# EasyEDA Pro project Meshtastic-MiniX-FakeTec.epro

# Schematic Schematic1_1
Board Name: Board1_1; Create Date: 2025-11-05; Page Name: P1; Project Name: Meshtastic-Mini; Schematic Name: Schematic1_1; Update Date: 2025-11-13; Company: TESLA; Drawed: chanchu; Page Size: A3; Version: V1.0
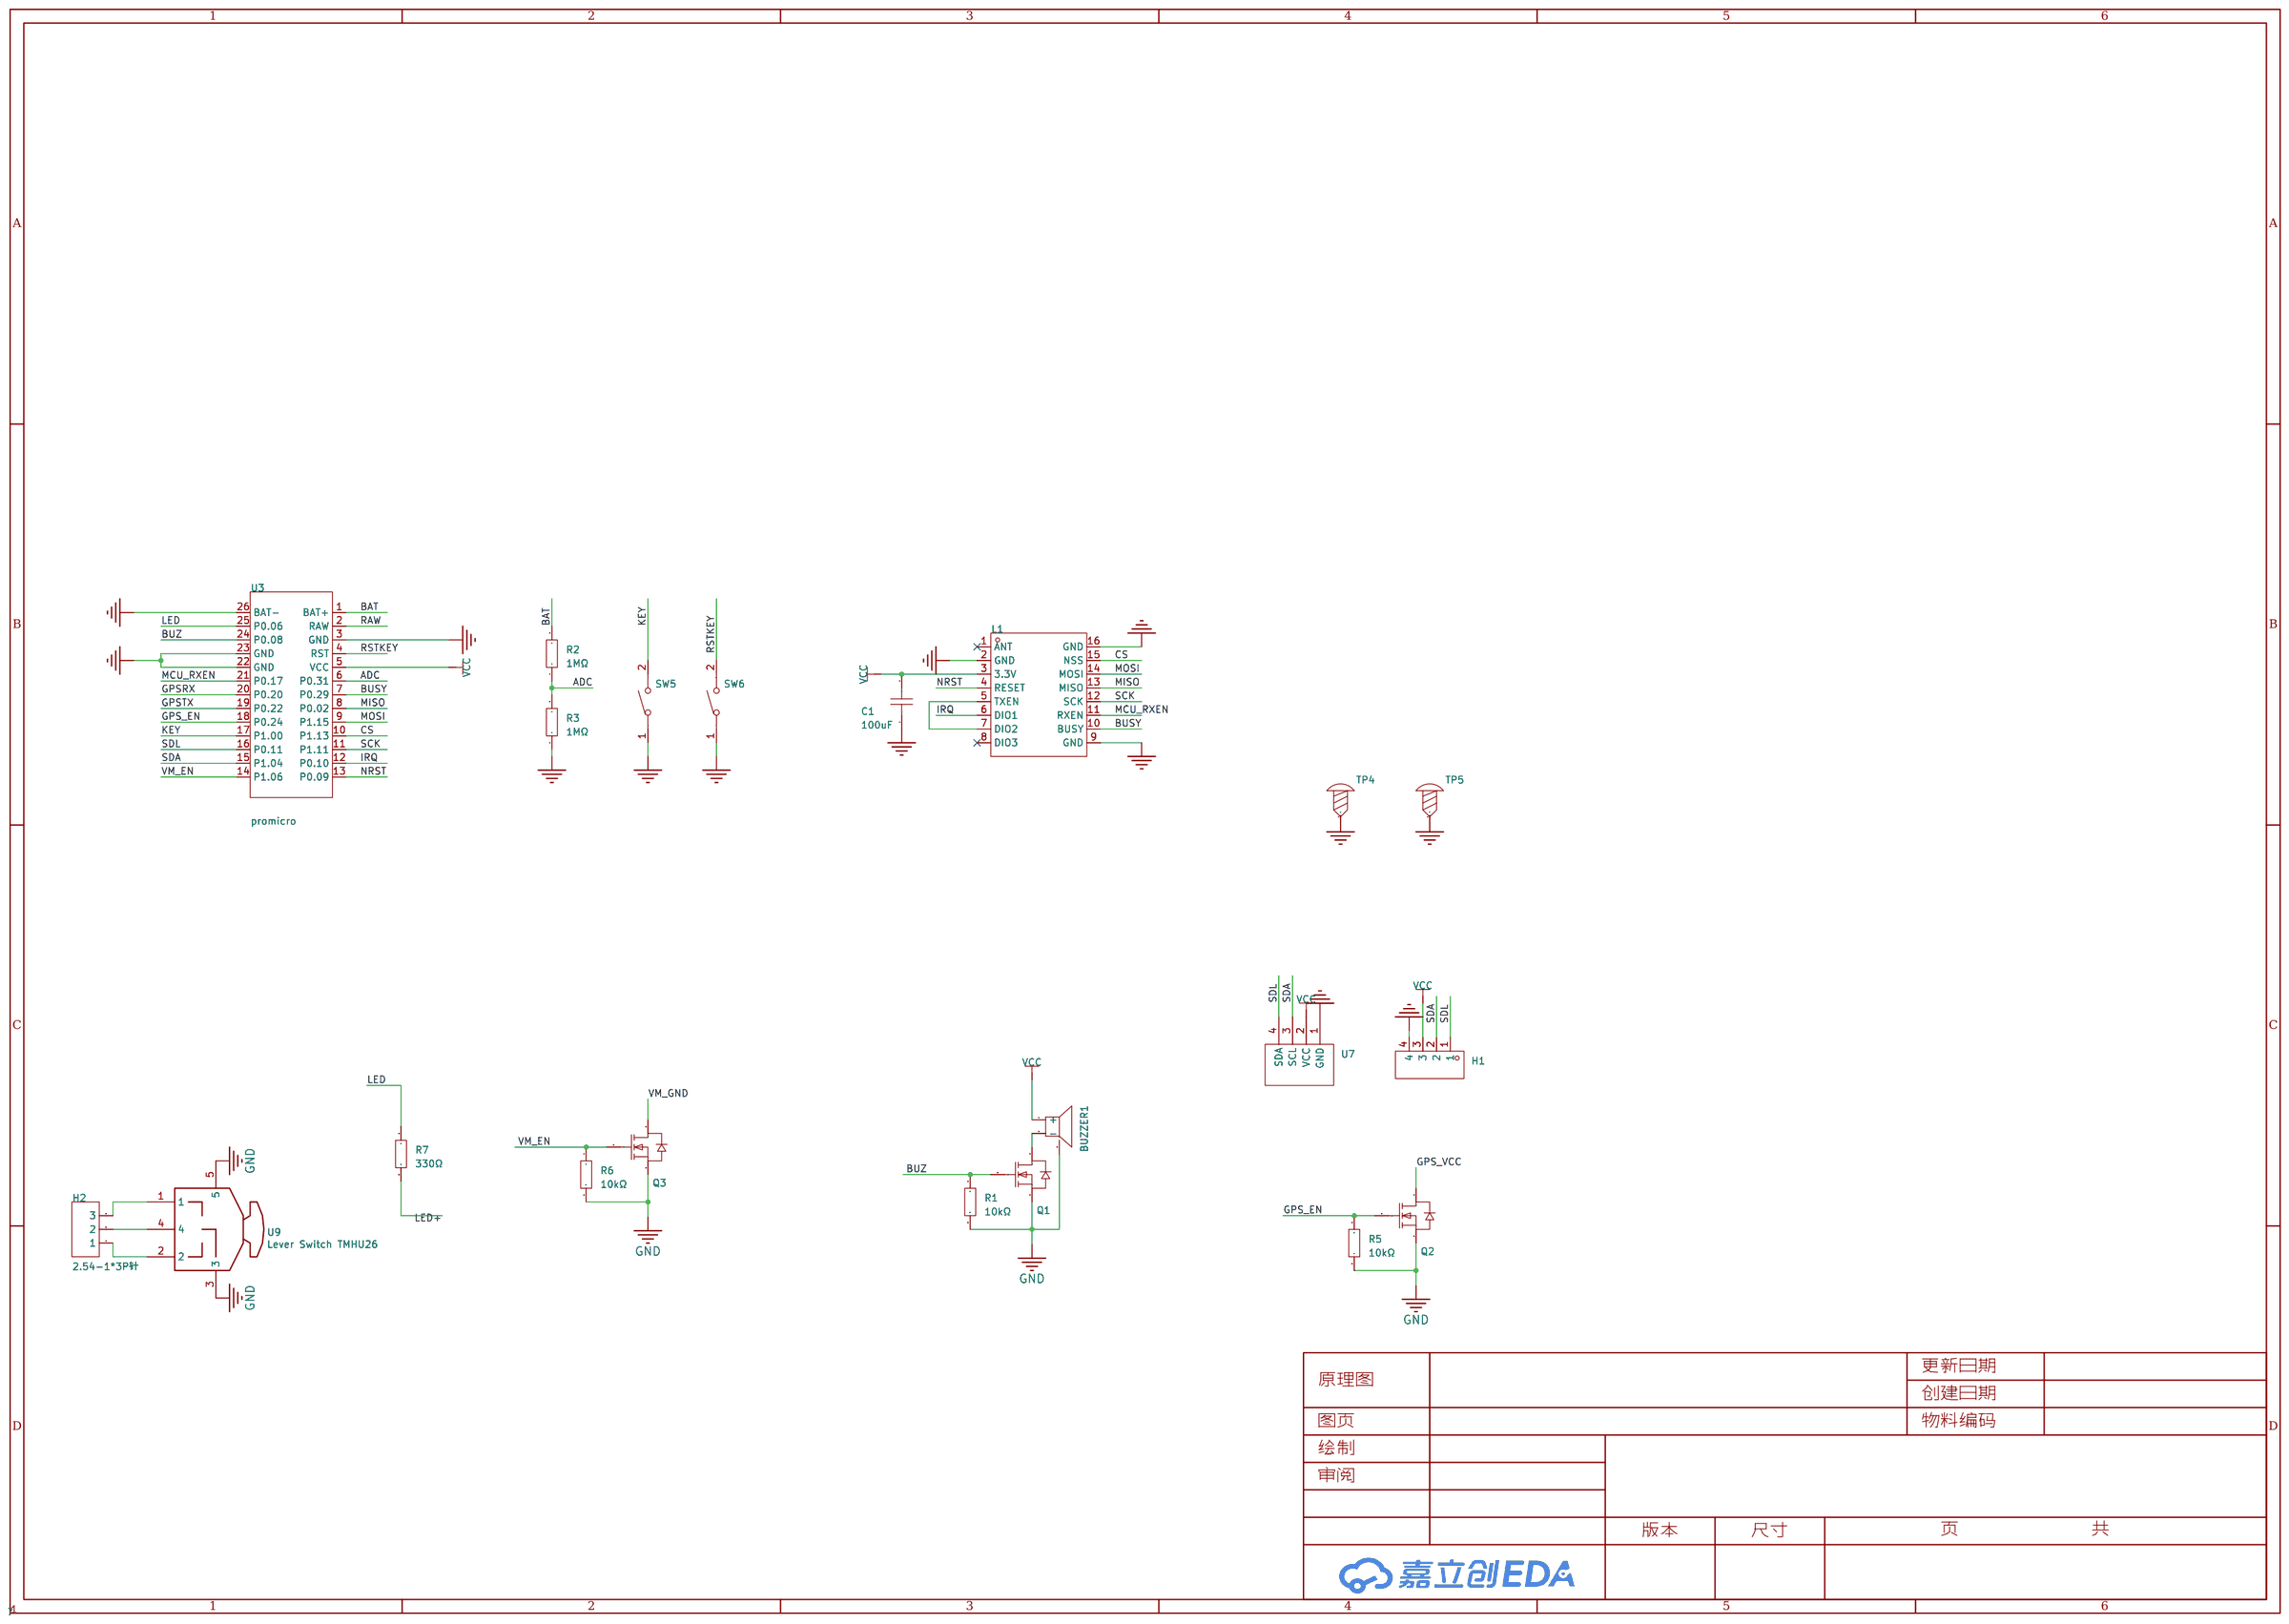
[diagram p0: schematic sheet]

## Parts
BUZZER1  4kHz  [BUZ-SMD_L5.0-W5.5-P4.60]
C1  100uF  [C1206]
H1  PZ254V-11-04P  [HDR-TH_4P-P2.54-V-M]
H2  2.54-1*3P针  [HDR-TH_3P-P2.54-V-M-1]
L1  Ra-01SH  [WIRELM-SMD_RA-01SH]
Q1  AO3400A  [SOT-23-3_L2.9-W1.3-P1.90-LS2.4-BR]
Q2  AO3400A  [SOT-23-3_L2.9-W1.3-P1.90-LS2.4-BR]
Q3  AO3400A  [SOT-23-3_L2.9-W1.3-P1.90-LS2.4-BR]
R1  10kΩ  [R0603]
R2  1MΩ  [R1206]
R3  1MΩ  [R1206]
R5  10kΩ  [R0603]
R6  10kΩ  [R0603]
R7  330Ω  [R0603]
SW5  TS-1088-AR02016  [SW-SMD_L3.9-W3.0-P4.45]
SW6  TS-1088-AR02016  [SW-SMD_L3.9-W3.0-P4.45]
TP4  -  [M1.2螺丝]
TP5  -  [M1.2螺丝]
U3  promicro  [nrf_promicro]
U7  -  [SSD1306]
U9  Lever Switch TMHU26  [tmhu26]

## Library data of the parts
BUZZER1 = MLT-5020: 驱动方式:无源(外部驱动);构造类型:电磁式;频率:4kHz;; Supplier Part: C94598; Manufacturer: 华能; Supplier Footprint: SMD,5x5mm; JLCPCB Part Class: 扩展库; Datasheet: https://atta.szlcsc.com/upload/public/pdf/source/20210811/111454390007D221D7259018FB170E62.pdf; Supplier: LCSC; Oscillator Circuit: 无源(外部驱动); Technology Type: 电磁式; Length: 5.2mm; Width: 5.2mm; Height: 2.5mm
C1 = HGC1206R5107M100NSPJ: 容值:100uF;精度:±20%;额定电压:10V;材质(温度系数):X5R;; LCSC Part Name: 100uF ±20% 10V; Supplier Part: C7432784; Manufacturer: Chinocera(华瓷); Supplier Footprint: 1206; JLCPCB Part Class: 扩展库; Datasheet: https://atta.szlcsc.com/upload/public/pdf/source/20240320/FAC3FEC40A78BC5CCCE96C232A94D860.pdf; Supplier: LCSC; Tolerance: ±20%; Voltage Rated: 10V; Temperature Coefficient: X5R
H1 = PZ254V-11-04P: 插针结构:1x4P;间距:2.54mm;行距:-;圆针/方针:方针;安装类型:直插;排数:单排;总PIN位数:4P;额定电流:3A;额定电压:250V;配合针长度:6mm;塑高:2.5mm;端接针长度:3mm;触头材质:-;工作温度范围:-40℃~+105℃;颜色:黑色;; LCSC Part Name: 间距:2.54mm 1x4P 直插 方针; Supplier Part: C2691448; Manufacturer: XFCN(兴飞); Supplier Footprint: 插件,P=2.54mm; JLCPCB Part Class: 扩展库; Datasheet: https://atta.szlcsc.com/upload/public/pdf/source/20200309/C492403_F9F19131791D08044AD4F84F8E751A34.pdf; Supplier: LCSC; Pin Structure: 1x4P; Pitch: 2.54mm; Circluar Pins/Square Pins: 方针; Mounting Type: 直插; Number of Rows: 单排; Number of Pins: 4P; Current Rating (Max): 3A; Voltage Rating (Max): 250V; Length of Mating Pin: 6mm; Insulation Height: 2.5mm; Length of End Connection Pin: 3mm; Operating Temperature Range: -40℃~+105℃; Color: 黑色
H2 = 2.54-1*3P针: Pin Structure:1x3P Pitch:2.54mm Row Spacing:- Circluar Pins/Square Pins:Pin Header Mounting Type:Through Hole Number of Rows:1 Number of Pins:3P Current Rating:3A Voltage Rating (Max):- Length of Mating Pin:6mm Insulation Height:2.5mm Length of End Connec; LCSC Part Name: 1x3P 间距:2.54mm 方针 直插; Supplier Part: C49257; Manufacturer: BOOMELE(博穆精密); Supplier Footprint: 插件,P=2.54mm; JLCPCB Part Class: Extended Part; Datasheet: https://item.szlcsc.com/datasheet/2.54-1*3P%25E9%2592%2588/50265.html; Supplier: LCSC; Pin Structure: 1x3P; Pitch: 2.54mm; Circluar Pins/Square Pins: Pin Header; Mounting Type: Through Hole; Number of Rows: 1; Number of Pins: 3P; Current Rating: 3A; Length of Mating Pin: 6mm; Insulation Height: 2.5mm; Length of End Connection Pin: 3mm; Contact Material: Brass; Contact Plating: Gold; Operating Temperature: -40℃~+105℃; Color: Black
L1 = Ra-01SH: 发射功率:22dBm;支持接口:SPI;接收灵敏度:-148dBm;; LCSC Part Name: LoRa模组 Ra-01SH; Supplier Part: C2764087; Manufacturer: Ai-Thinker(安信可); Supplier Footprint: SMD-16P; JLCPCB Part Class: 扩展库; Datasheet: https://atta.szlcsc.com/upload/public/pdf/source/20210401/C2764087_37E80225C9871B7445E5F231DF1A9FD5.pdf; Supplier: LCSC; Output Power: 22dBm; Support Interface: SPI; Modulation System: LoRa；OOK；MSK；GFSK；FSK；GMSK; Operating Voltage: 3.3V; Antenna Type: IPEX接口; Receive  Current: 4.2mA; Send  Current: 140mA; Sensitivity: -148dBm; Operating Temperature: -40℃~+85℃
Q1-Q3 = AO3400A_C20917: 类型:1个N沟道;漏源电压(Vdss):30V;连续漏极电流(Id):5.7A;功率(Pd):1.4W;导通电阻(RDS(on)@Vgs,Id):26.5mΩ@10V,5.7A;阈值电压(Vgs(th)@Id):1.5V@250uA;; LCSC Part Name: 1个N沟道 耐压:30V 电流:5.7A; Supplier Part: C20917; Manufacturer: AOS; Supplier Footprint: SOT-23-3L; JLCPCB Part Class: Basic Part; Datasheet: https://atta.szlcsc.com/upload/public/pdf/source/20140107/1457706668533.pdf; Supplier: LCSC; Type: 1个N沟道; Drain Source Voltage (Vdss): 30V; Continuous Drain Current (Id): 5.7A; Power Dissipation (Pd): 1.4W; Drain Source On Resistance (RDS(on)@Vgs,Id): 26.5mΩ@10V,5.7A; Gate Threshold Voltage (Vgs(th)@Id): 1.5V@250uA; Total Gate Charge (Qg@Vgs): 7nC@4.5V; Input Capacitance (Ciss@Vds): 630pF@15V; Operating Temperature: -55℃~+150℃@(Tj)
R1 R5 R6 = 0603WAF1002T5E: 电阻类型:厚膜电阻;阻值:10kΩ;精度:±1%;功率:100mW;; LCSC Part Name: 厚膜电阻 10kΩ ±1% 100mW; Supplier Part: C25804; Manufacturer: UNI-ROYAL(厚声); Supplier Footprint: 0603; JLCPCB Part Class: 基础库; Datasheet: https://atta.szlcsc.com/upload/public/pdf/source/20200306/C422600_1E6D84923E4A46A82E41ADD87F860B5C.pdf; Supplier: LCSC; Type: 厚膜电阻; Tolerance: ±1%; Power(Watts): 100mW; Temperature Coefficient: ±100ppm/℃; Overload Voltage (Max): 75V; Operating Temperature Range: -55℃~+155℃
R2 R3 = 1206W4F1004T5E: 电阻类型:厚膜电阻;阻值:1MΩ;精度:±1%;功率:250mW;最大工作电压:200V;温度系数:±100ppm/℃;; LCSC Part Name: 1MΩ ±1% 250mW 厚膜电阻; Supplier Part: C17927; Manufacturer: UNI-ROYAL(厚声); Supplier Footprint: 1206; JLCPCB Part Class: 基础库; Datasheet: https://atta.szlcsc.com/upload/public/pdf/source/20200306/C422600_1E6D84923E4A46A82E41ADD87F860B5C.pdf; Supplier: LCSC; Type: 厚膜电阻; Tolerance: ±1%; Power(Watts): 250mW; Overload Voltage (Max): 200V; Temperature Coefficient: ±100ppm/℃; Operating Temperature Range: -55℃~+155℃
R7 = 0603WAF3300T5E: Type:Thick Film Resistors Resistance: Tolerance:±1% Tolerance:±1% Power(Watts): Overload Voltage (Max): Temperature Coefficient:±100ppm/℃ Temperature Coefficient:±100ppm/℃ Operating Temperature Range:-55℃~+155℃ Operating Temperature Range:-55℃~+155℃; LCSC Part Name: 330Ω ±1% 100mW 厚膜电阻; Supplier Part: C23138; Manufacturer: UNI-ROYAL(厚声); Supplier Footprint: 0603; JLCPCB Part Class: Basic Part; Datasheet: https://atta.szlcsc.com/upload/public/pdf/source/20200306/C422600_1E6D84923E4A46A82E41ADD87F860B5C.pdf; Supplier: LCSC; Type: Thick Film Resistors; Tolerance: ±1%; Temperature Coefficient: ±100ppm/℃; Operating Temperature Range: -55℃~+155℃
SW5 SW6 = TS-1088-AR02016: 电路结构:单刀单掷;按钮形状:圆形按钮;作用力:160gf;安装方式:立贴;开关长度:4mm;开关宽度:3mm;开关高度:2mm;带支架:不带;触点电流:50mA;额定电压(DC):12V;绝缘电阻:100MΩ;机械寿命:10万次;; LCSC Part Name: 4*3*2mm 立贴 轻触开关; Supplier Part: C720477; Manufacturer: XUNPU(讯普); Supplier Footprint: SMD; JLCPCB Part Class: 扩展库; Datasheet: https://atta.szlcsc.com/upload/public/pdf/source/20200810/C720475_60D09DD6C54279ADDB2DC25100F1CC11.pdf; Supplier: LCSC; Circuit: 单刀单掷; Actuator Style: 圆形按钮; Operating Force: 160gf; Mounting Style: 立贴; Switch Length: 4mm; Switch Width: 3mm; Switch Height: 2mm; Strike Gundam: 不带; Contact Current: 50mA; Voltage Rating (DC): 12V; Insulation Resistance: 100MΩ; Actuator/Cap Color: 黑色; Pin Style: SMD接片; Mechanical Life: 10万次; Operating Temperature: -30℃~+80℃
TP4 TP5 = M1.2螺丝: Supplier Footprint: 插件
U3 = nrf52840_promicro
U7 = SSD1306: Supplier Part: C5127228
U9 = Lever Switch TMHU26: Contributor: cedric.stoquer; spicePre: U

## Nets
GND: BUZZER1.3(NC) C1.1 H1.4 L1.2(GND) L1.9(GND) L1.16(GND) Q1.2(S) Q2.2(S) Q3.2(S) R1.2 R3.1 R5.2 R6.2 SW5.1 SW6.1 TP4.1 TP5.1 U3.3(GND) U3.22(GND) U3.23(GND) U3.26(BAT-) U7.1(GND) U9.3 U9.5
VCC: BUZZER1.1(+) C1.2 H1.3 L1.3(3.3V) U3.5(VCC) U7.2(VCC)
ADC: R2.1 R3.2 U3.6(P0.31)
BAT: R2.2 U3.1(BAT+)
BUSY: L1.10(BUSY) U3.7(P0.29)
BUZ: Q1.1(G) R1.1 U3.24(P0.08)
CS: L1.15(NSS) U3.10(P1.13)
GPS_EN: Q2.1(G) R5.1 U3.18(P0.24)
GPS_VCC: Q2.3(D)
GPSRX: U3.20(P0.20)
GPSTX: U3.19(P0.22)
IRQ: L1.6(DIO1) U3.12(P0.10)
KEY: SW5.2 U3.17(P1.00)
LED: R7.1 U3.25(P0.06)
LED+: R7.2
MCU_RXEN: L1.11(RXEN) U3.21(P0.17)
MISO: L1.13(MISO) U3.8(P0.02)
MOSI: L1.14(MOSI) U3.9(P1.15)
NRST: L1.4(RESET) U3.13(P0.09)
RAW: U3.2(RAW)
RSTKEY: SW6.2 U3.4(RST)
SCK: L1.12(SCK) U3.11(P1.11)
SDA: H1.2 U3.15(P1.04) U7.3(SCL)
SDL: H1.1 U3.16(P0.11) U7.4(SDA)
VM_EN: Q3.1(G) R6.1 U3.14(P1.06)
VM_GND: Q3.3(D)
$1N1440: L1.5(TXEN) L1.7(DIO2)
$1N8056: BUZZER1.2(-) Q1.3(D)
$1N18617: H2.2 U9.4
$1N18621: H2.3 U9.1
$1N18625: H2.1 U9.2

Not connected (* = marked no-connect by the designer): L1 1(ANT)* 8(DIO3)*

# Board PCB1_1
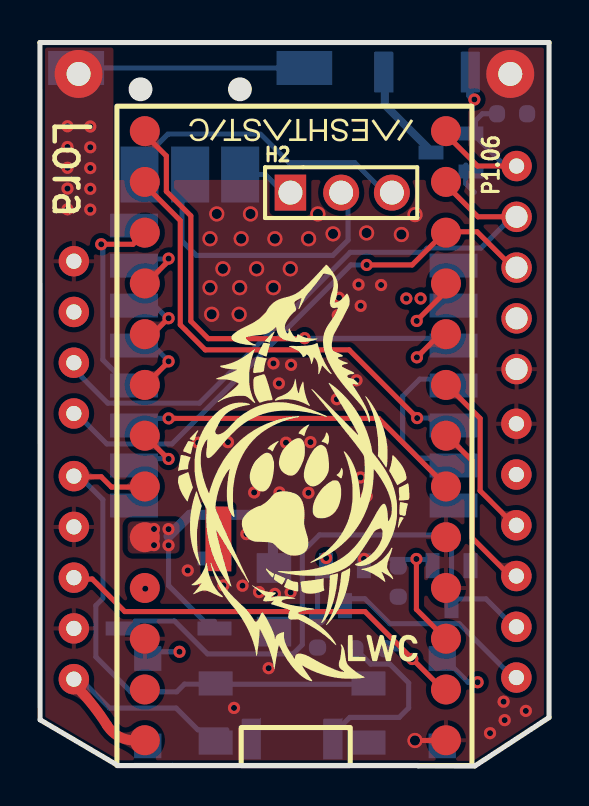
[diagram p1: board, top side]
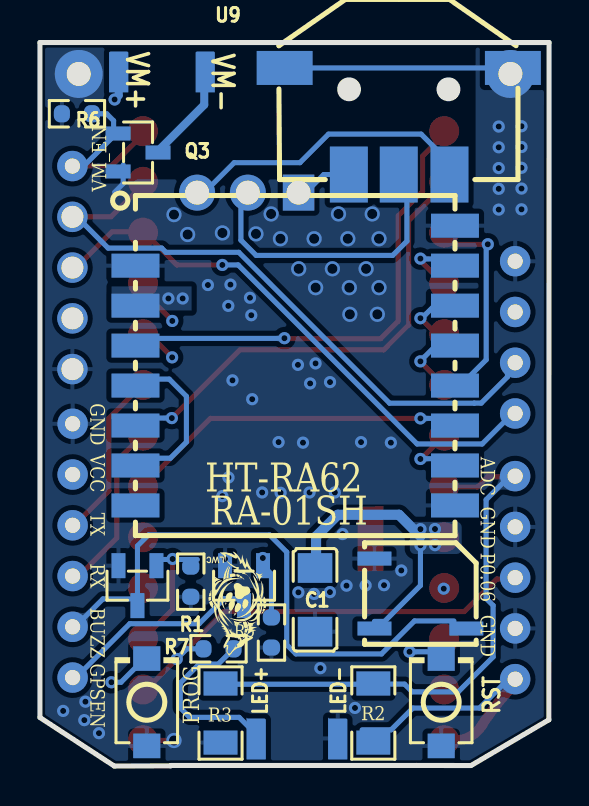
[diagram p2: board, bottom side, seen from below]

Outline 25.5 x 36.21 mm; copper layers: Top Layer, GND, VCC, Bottom Layer. Coordinates in mm from the lower left corner of the outline.
Outline path: 0,36.21 25.5,36.21 25.5,2.43 21.77,0 18.95,0.01 18.93,0.03 6.64,0.03 3.91,0.03 0.01,2.31 0,36.21
Stack: Top Layer 0.035mm 外层铜厚1oz / Dielectric1 0.2104mm 7628 RC49% 8.6mil / GND 0.0152mm 内层铜厚 / Dielectric2 1.065mm 1.1mm H/HOZ Copper / VCC 0.0152mm 内层铜厚 / Dielectric3 0.2104mm 7628 RC49% 8.6mil / Bottom Layer 0.035mm 外层铜厚1oz

## Design rules (mm)
template: 自定义配置
spacing copperThickness1oz (default): track to track 0.102, other pairs 0.152 to 0.3
spacing copperThickness2oz: track to track 0.203, other pairs 0.152 to 0.3
track width copperThickness1oz (default): min 0.127, default 0.254, max 2.54
track width copperThickness2oz: min 0.203, default 0.254, max 2.54
differential pair differentialPair (default): width min 0.127, default 0.254, max 2.54; gap min 0.152, default 0.152
via viaSize (default): diameter min 0.5, default 0.61, max 10; hole min 0.254, default 0.305, max 6.3

## Placement (name value [footprint] x y rotation side)
BUZZER1  4kHz  [BUZ-SMD_L5.0-W5.5-P4.60]  6.44 8.63 180 bottom
C1  100uF  [C1206]  11.72 8.32 90 bottom
H1  PZ254V-11-04P  [HDR-TH_4P-P2.54-V-M]  23.87 23.67 270 top
H2  2.54-1*3P针  [HDR-TH_3P-P2.54-V-M-1]  15.08 28.69 0 top
L1  Ra-01SH  [WIRELM-SMD_RA-01SH]  12.71 20.04 180 bottom
NOREF  -  [Pad_e441]  1.7 11.97 0 top
NOREF#2  -  [Pad_e1023]  23.86 4.43 0 top
NOREF#3  -  [Pad_e12642]  23.86 12.05 0 top
NOREF#4  -  [Pad_e3370]  23.86 17.13 0 top
NOREF#5  -  [Pad_e506]  1.7 4.35 0 top
NOREF#6  -  [Pad_e252]  17.22 34.73 0 top
NOREF#7  -  [Pad_e4264]  23.86 6.97 0 top
NOREF#8  -  [Pad_e1170]  1.7 14.51 0 top
NOREF#9  -  [Pad_e263]  21.55 34.73 0 top
NOREF#10  -  [Pad_e295]  1.7 9.43 0 top
NOREF#11  -  [Pad_e3369]  23.86 14.59 0 top
NOREF#12  -  [Pad_e63]  14.67 1.38 0 top
NOREF#13  -  [Pad_e530]  1.7 6.89 0 top
NOREF#14  -  [Pad_e3368]  23.86 9.51 0 top
NOREF#15  -  [Pad_e16]  8.94 11.37 0 top
NOREF#16  -  [Pad_e79]  10.58 1.38 0 top
NOREF#17  -  [Pad_e4744]  23.87 30.02 0 top
Q1  AO3400A  [SOT-23-3_L2.9-W1.3-P1.90-LS2.4-BR]  20.61 9.03 90 bottom
Q2  AO3400A  [SOT-23-3_L2.9-W1.3-P1.90-LS2.4-BR]  15.27 9.03 90 bottom
Q3  AO3400A  [SOT-23-3_L2.9-W1.3-P1.90-LS2.4-BR]  20.58 30.7 0 bottom
R1  10kΩ  [R0603]  17.94 9.22 270 bottom
R2  1MΩ  [R1206]  8.8 2.65 270 bottom
R3  1MΩ  [R1206]  16.45 2.65 90 bottom
R5  10kΩ  [R0603]  13.9 6.68 270 bottom
R6  10kΩ  [R0603]  23.64 32.64 0 bottom
R7  330Ω  [R0603]  16.55 5.87 180 bottom
SW5  TS-1088-AR02016  [SW-SMD_L3.9-W3.0-P4.45]  20.14 3.19 90 bottom
SW6  TS-1088-AR02016  [SW-SMD_L3.9-W3.0-P4.45]  5.4 3.19 90 bottom
TP4  -  [M1.2螺丝]  1.94 34.63 0 top
TP5  -  [M1.2螺丝]  23.55 34.63 0 top
U3  promicro  [nrf_promicro]  12.87 16.66 180 top
U7  -  [SSD1306]  13.43 21.45 270 bottom
U9  Lever Switch TMHU26  [tmhu26]  7.53 34.43 180 bottom

## Footprints (pads in the part's own frame, mm; a bottom-side part is the same pattern mirrored in y, then rotated)
BUZ-SMD_L5.0-W5.5-P4.60
  rect 1.7x0.7 smd: 1(-2.3,-1.75) 2(2.3,-1.75) 3(-2.3,1.75)
C1206
  rect 1.485x1.728 smd: 1(-1.593,0) 2(1.593,0)
HDR-TH_3P-P2.54-V-M-1
  rect 1.575x1.8 hole 1.2: 1(-2.54,0)
  round 1.8 hole 1.2: 2(0,0) 3(2.54,0)
HDR-TH_4P-P2.54-V-M
  round 1.524 hole 1.1: 1(-3.81,0) 2(-1.27,0) 3(1.27,0) 4(3.81,0)
M1.2螺丝
  round 2.4 hole 1.2: 1(0,0)
nrf_promicro
  round 1.501 smd: 1(7.62,15.367) 2(7.62,12.827) 3(7.62,10.287) 4(7.62,7.747) 5(7.62,5.207) 6(7.62,2.667) 7(7.62,0.127) 8(7.62,-2.413) 9(7.62,-4.953) 10(7.62,-7.493) 11(7.62,-10.033) 12(7.62,-12.573) 13(7.62,-15.113) 14(-7.461,-15.113) 15(-7.461,-12.573) 16(-7.461,-10.033) 17(-7.461,-7.493) 18(-7.461,-4.953) 19(-7.461,-2.413) 20(-7.461,0.127) 21(-7.461,2.667) 22(-7.461,5.207) 23(-7.461,7.747) 24(-7.461,10.287) 25(-7.461,12.827) 26(-7.461,15.367)
Pad_e16
  custom 1.296x3.261 smd: 4(0,0)
Pad_e63
  custom 0.963x2.091 smd far side: 27(0,0)
Pad_e79
  custom 0.963x2.091 smd far side: 27(0,0)
Pad_e252
  custom 0.963x2.04 smd far side: 27(0,0)
Pad_e263
  custom 0.963x2.04 smd far side: 27(0,0)
Pad_e295
  round 1.524 hole 0.762: 1(0,0)
Pad_e441
  round 1.524 hole 0.762: 1(0,0)
Pad_e506
  round 1.524 hole 0.762: 1(0,0)
Pad_e530
  round 1.524 hole 0.762: 1(0,0)
Pad_e1023
  round 1.524 hole 0.762: 1(0,0)
Pad_e1170
  round 1.524 hole 0.762: 1(0,0)
Pad_e3368
  round 1.524 hole 0.762: 1(0,0)
Pad_e3369
  round 1.524 hole 0.762: 1(0,0)
Pad_e3370
  round 1.524 hole 0.762: 1(0,0)
Pad_e4264
  round 1.524 hole 0.762: 1(0,0)
Pad_e4744
  round 1.524 hole 0.762: 1(0,0)
Pad_e12642
  round 1.524 hole 0.762: 1(0,0)
R0603
  rrect 0.806x0.864 smd: 1(-0.753,0) 2(0.753,0)
R1206
  rect 1.208x1.701 smd: 1(-1.479,0) 2(1.479,0)
SOT-23-3_L2.9-W1.3-P1.90-LS2.4-BR
  rect 1.25x0.7 smd: 1(1,-0.95) 2(1,0.95) 3(-1,0)
SSD1306
  round 1.524 hole 0.762: 1(-3.81,11.73) 2(-1.27,11.73) 3(1.27,11.73) 4(3.81,11.73)
SW-SMD_L3.9-W3.0-P4.45
  rect 1.23x1.36 smd: 1(-2.185,0) 2(2.185,0)
tmhu26
  rect 1.9x2.8 smd: 1(2.54,-4.826) 2(-2.5,-4.826) 4(0,-4.826)
  rect 2.8x1.7 smd: 3(-5.715,0.508) 5(5.715,0.508)
WIRELM-SMD_RA-01SH
  rect 2.4x1.2 smd: 2(-8,5) 3(-8,3) 4(-8,1) 5(-8,-1) 6(-8,-3) 7(-8,-5) 8(-8,-7) 9(8,-7) 10(8,-5) 11(8,-3) 12(8,-1) 13(8,1) 14(8,3) 15(8,5) 16(8,7)

## Nets
GND: BUZZER1.3 C1.1 H1.4 L1.2 L1.9 L1.16 NOREF.1 NOREF#4.1 NOREF#13.1 NOREF#16.27 Q1.2 Q2.2 Q3.2 R1.2 R3.1 R5.2 R6.2 SW5.1 SW6.1 TP4.1 TP5.1 U3.3 U3.22 U3.23 U3.26 U7.1 U9.3 U9.5
VCC: BUZZER1.1 C1.2 H1.3 L1.3 NOREF#9.27 NOREF#11.1 U3.5 U7.2
ADC: NOREF#8.1 R2.1 R3.2 U3.6
BAT: NOREF#5.1 R2.2 U3.1
BUSY: L1.10 U3.7
BUZ: Q1.1 R1.1 U3.24
CS: L1.15 U3.10
GPS_EN: Q2.1 R5.1 U3.18
GPS_VCC: NOREF#2.1 Q2.3
GPSRX: NOREF#14.1 U3.20
GPSTX: NOREF#3.1 U3.19
IRQ: L1.6 U3.12
KEY: SW5.2 U3.17
LED: NOREF#10.1 R7.1 U3.25
LED+: NOREF#12.27 R7.2
MCU_RXEN: L1.11 U3.21
MISO: L1.13 U3.8
MOSI: L1.14 U3.9
NRST: L1.4 U3.13
RAW: U3.2
RSTKEY: SW6.2 U3.4
SCK: L1.12 U3.11
SDA: H1.1 U3.15 U7.3
SDL: H1.2 U3.16 U7.4
VM_EN: NOREF#17.1 Q3.1 R6.1 U3.14
VM_GND: NOREF#6.27 Q3.3
$1N1440: L1.5 L1.7
$1N8056: BUZZER1.2 NOREF#7.1 Q1.3
$1N18617: H2.2 U9.4
$1N18621: H2.3 U9.1
$1N18625: H2.1 U9.2

Pads without a net: L1 8; NOREF#15 4

## Via types
v1: diameter 0.61, hole 0.305, Top Layer to Bottom Layer, 70 vias
v2: diameter 0.762, hole 0.508, Top Layer to Bottom Layer, 20 vias

## Routing (per net, layer and track width the routed paths; a pad name or vN(x,y) marks a point on that pad's centre or on a via; arc(x,y) is an arc through that point)
GND: length 15
  Top Layer w0.254: v2(18.78,1.28) 20.41,1.28 20.42,1.28
  Bottom Layer w0.254: U9.3 1.88,34.93 1.58,34.63 ; 21.76,28.71 21.33,29.14 21.33,30.08
  vias: v1(1.38,32.02) v1(1.38,30.98) v1(1.38,29.94) v1(1.38,28.9) v1(1.38,27.86) v1(2.52,32) v1(2.52,30.96) v1(2.52,29.92) v1(2.52,28.88) v1(2.52,27.85) v1(7.4,9.79) v1(7.92,16.18) v1(8.27,9.05) v1(9.19,9.04) v1(9.42,16.21) v1(9.72,2.91) v1(10.14,9.03) v1(10.34,11.61) v1(10.73,13.69) v1(10.97,19.21) v1(10.97,8.7) v1(11.45,4.9) v1(11.69,20.15) v1(11.77,8.61) v1(11.97,19.15) v1(12,13.69) v1(12.32,16.18) v1(12.58,20.08) v1(12.55,8.69) v1(13.44,13.67) v1(13.55,16.21) v1(14.37,13.69) v1(14.91,22.56) v1(14.87,18.36) v1(14.98,23.43) v1(15.85,19.3) v1(15.96,24.09) v1(16.06,23.03) v1(16.05,14.44) v1(16.23,10.37) v1(16.36,13.51) v1(17.08,24.07) v1(22.54,1.64) v1(23.22,3.22) v1(23.27,2.3) v1(24.33,2.76) v2(8.52,26.39) v2(8.52,23.94) v2(8.6,22.61) v2(8.86,27.63) v2(9.16,24.88) v2(10,23.94) v2(9.98,22.61) v2(10.08,26.39) v2(10.54,27.63) v2(10.85,24.88) v2(11.69,23.94) v2(11.77,26.39) v2(12.54,24.88) v2(13.45,26.39) v2(13.92,27.63) v2(14.68,26.63) v2(16.36,26.68) v2(18.1,26.6) v2(18.78,27.59)
VCC: length 70.2
  VCC w0.254: H1.3 23.55,22.4 22.73,21.57 22.73,15.72 NOREF#11.1
  VCC w0.381: 5.87,11.82 5.15,11.82 4.77,12.2 4.77,19.67 1.85,22.59 ; 18.35,23.48 18.07,23.48 v1(6.44,11.85) 6.44,11.17 6.57,11.05 ; v1(19.06,23.4) 22.5,23.4 23.52,22.37
  VCC w0.4: v1(21.76,33.36) 21.76,24.52 H1.3
  Bottom Layer w0.254: 8.74,7.24 8.24,7.24 6.44,9.03 v1(6.44,11.05)
  Bottom Layer w0.4: v1(21.76,33.36) 21.55,33.56 NOREF#9.27
  Bottom Layer w0.508: 6.44,11.5 7.52,12.57 10.58,12.57 11.67,11.48 11.67,10.01 11.69,10
  vias: v1(5.71,11.86) v1(5.71,11.05) v1(18.35,23.4)
ADC: length 27
  Top Layer w0.254: 5.15,13.96 3.58,13.96 3.07,14.47 2.2,14.47
  Bottom Layer w0.254: R3.2 16.41,4.09 8.84,4.09 R2.1 8.77,4.1 7.24,4.1 6.85,3.71 4.55,3.71 2.8,5.46 2.8,8.04 3.15,8.39 3.15,13.33 2.3,14.18
BAT: length 13.1
  Top Layer w0.508: 5.21,1.36 arc(4.17,1.38) 3.37,2.03 arc(2.61,3.09) 1.74,4.06
  Bottom Layer w0.254: 9.36,1.81 7.91,1.81 6.82,2.9 3.48,2.9 2.03,4.35
BUSY: length 3.4
  Top Layer w0.254: 6.41,15.37 6.41,15.37 5.3,16.48 5.22,16.48
  Bottom Layer w0.254: 6.41,15.37 6.4,15.38 4.66,15.38
  vias: v1(6.44,15.37)
BUZ: length 6.3
  Top Layer w0.254: v1(18.85,10.36) 18.85,7.84 20.16,6.53
  Bottom Layer w0.254: 19.58,10.35 19.57,10.34 17.62,10.34
CS: length 3.2
  Top Layer w0.254: 5.31,24.15 6.44,25.28 6.44,25.39
  Bottom Layer w0.254: 5.19,25.38 6.55,25.38 6.54,25.39 6.44,25.39
  vias: v1(6.44,25.39)
GPS_EN: length 16.4
  Top Layer w0.254: 20.16,21.51 19.93,21.51 v1(18.88,20.45)
  VCC w0.254: v1(18.88,20.45) 15,16.58 15,11.08 v1(14.33,10.41)
  Bottom Layer w0.254: Q2.1 13.9,9.6 R5.1 ; v1(14.33,10.41) 14.33,10.41
GPS_VCC: length 9.9
  Bottom Layer w0.254: 15.34,8.37 16.27,8.37 17.52,7.12 21,7.12 23.63,4.49
GPSRX: length 8
  Top Layer w0.254: 20.61,16.31 21.64,15.28 21.64,11.41 23.57,9.49
GPSTX: length 8.3
  Top Layer w0.254: 20.43,19.01 22.04,17.4 22.04,13.77 23.77,12.05
IRQ: length 22.3
  Top Layer w0.254: 18.9,17.43 18.88,17.43 15.48,20.83 8.28,20.83 7.03,22.08 7.03,27.3 5.49,28.84
  Bottom Layer w0.254: 19.99,17.45 19.95,17.41 v1(18.89,17.41)
KEY: length 25
  Top Layer w0.254: U3.17 20.33,23.75 18.87,22.29 v1(18.87,22.27)
  VCC w0.254: v1(21.92,4.19) 21.22,4.89 21.22,21.12 20.06,22.27 v1(18.87,22.27)
  Bottom Layer w0.254: 20.02,5.62 21.44,4.19 v1(21.92,4.19)
LED: length 21.6
  Top Layer w0.254: 2.08,9.2 2.24,9.36 2.62,9.36 4.25,7.73 16.28,7.73 19.91,4.1 19.93,4.1
  Bottom Layer w0.254: v1(18.65,5.36) 18.14,5.87 R7.1
LED+: length 9.1
  Bottom Layer w0.254: R7.2 16.57,5.1 17.52,5.1 18.47,4.16 18.47,2.91 17.99,2.44 15.52,2.44 14.59,1.5
MCU_RXEN: length 17.1
  Top Layer w0.254: v1(6.44,17.4) 16.96,17.4 20.33,14.03 20.33,13.93
  Bottom Layer w0.254: 6.44,17.42 6.41,17.38 ; 6.41,17.4 4.7,17.4
MISO: length 2.8
  Top Layer w0.254: 5.27,19.36 5.57,19.36 6.46,20.25
  Bottom Layer w0.254: 6.46,20.25 5.61,21.1 5.54,21.1
  vias: v1(6.44,20.25)
MOSI: length 3.6
  Top Layer w0.254: v1(6.44,22.41) 6.43,22.41 5.63,21.61 5.27,21.61
  Bottom Layer w0.254: 4.72,23.39 5.39,23.39 6.37,22.41 v1(6.44,22.41)
NRST: length 23.2
  Top Layer w0.254: v1(13.25,21.41) 13.23,21.39 8.43,21.39 7.56,22.26 7.56,27.53 6.33,28.76 6.33,30.53 5.61,31.25 5.61,31.48
  Bottom Layer w0.254: v1(13.25,21.41) 13.26,21.4 20.26,21.4 20.35,21.31
RSTKEY: length 5.6
  VCC w0.254: v1(6.99,5.72) 6.99,7.16 v1(5.27,8.87)
  Bottom Layer w0.254: v1(6.99,5.72) 5.32,5.72 5.31,5.73
SCK: length 10.3
  Top Layer w0.254: 5.24,26.69 4.66,26.11 v1(3.07,26.11)
  Bottom Layer w0.254: L1.12 4.44,19.04 3.15,20.33 3.15,26.03 v1(3.07,26.11)
SDA: length 30.4
  Top Layer w0.254: 20.67,29.25 20.67,28.75 21.94,27.48 23.77,27.48
  Bottom Layer w0.254: 23.7,27.27 23.43,27.27 22.08,25.92 19.4,25.92 19.19,25.71 15.54,25.71 7.99,18.16 3.75,18.16 3.74,18.16 3.4,18.16 2.08,19.47 2.08,19.82
SDL: length 27
  Top Layer w0.254: 23.98,24.65 21.89,26.73 20.79,26.73 ; v1(16.36,25.08) 18.64,25.08 20.06,26.49 20.06,26.63
  Bottom Layer w0.254: v1(16.36,25.08) 15.57,25.08 6.61,16.12 3.35,16.12 2.06,17.4
VM_EN: length 8.6
  Top Layer w0.254: 23.87,30.03 21.91,30.03 20.68,31.26 20.68,31.39
  Bottom Layer w0.254: R6.1 22.15,32.64 21.81,32.29 21.81,31.52 23.41,29.92 23.77,29.92 NOREF#17.1
VM_GND: length 5
  Bottom Layer w0.4: NOREF#6.27 17.27,34.68 17.27,33.09 19.58,30.78 Q3.3
$1N1440: length 7.4
  Bottom Layer w0.254: 20.48,19.36 19.02,19.36 18.16,18.5 18.16,16.21 18.97,15.4 20.24,15.4
$1N8056: length 28.3
  Bottom Layer w0.254: 23.72,6.99 22.34,8.36 20.61,8.36 20.61,11.01 20.06,11.57 14,11.57 13.14,10.71 13.14,6.07 12.68,5.61 8.39,5.61 6.74,7.26 4.77,7.26
$1N18617: length 15.1
  Bottom Layer w0.254: 14.73,28.69 15.43,27.99 15.43,26.32 14.67,25.55 7.83,25.55 7.12,26.27 7.12,29.19 U9.4
$1N18621: length 14.7
  Bottom Layer w0.254: U9.1 4.99,30.2 6.41,31.62 11.05,31.62 12.47,30.19 15.77,30.19 17.27,28.69
$1N18625: length 2.5
  Bottom Layer w0.254: U9.2 11.28,29.6 12.19,28.69

## Copper pours and planes (outline as drawn; the poured copper is in the pictures)
GND on Top Layer: 3.68,37.21 3.68,29.33 21.45,29.33 21.45,37.28 26.68,37.28 26.68,-2.63 25.99,-3.32 -0.77,-3.32 -1.7,-2.4 -1.7,37.21
GND on Bottom Layer: 3.68,37.21 3.68,29.36 21.49,29.36 21.49,37.01 28.02,37.01 28.02,0.01 -1.38,0.01 -1.38,37.21
GND on GND: 0.26,35.95 25.24,35.95 25.24,0.26 0.26,0.26
GND on VCC: 3.64,29.39 21.46,29.39 21.46,38.36 26.1,38.36 26.07,-6.31 16.79,-6.31 16.53,-6.05 16.53,-1.45 16.61,-1.37 -0.39,-1.37 -0.39,38.52 3.64,38.52
VCC on Top Layer: 4.39,12.24 6.99,12.24 6.99,10.64 4.39,10.64
VCC on Bottom Layer: 17.9,24 21.91,24 21.91,22.8 17.9,22.8
VCC on Bottom Layer: 4.38,12.22 6.97,12.22 6.97,10.61 4.38,10.61
VCC on VCC: 17.66,24 19.51,24 19.51,22.8 17.66,22.8
VCC on VCC: 4.51,12.24 7,12.24 7,10.64 4.51,10.64

Small or netless copper shapes (teardrops, artwork), in the pictures only: 26 on Top Layer, 12 on Bottom Layer, 20 on GND, 11 on VCC

## Text on the board
Bottom Silkscreen Layer: LED- | LED+ | RST | VM- | VM+ | VM_EN | ADC | GND | P0.06 | VCC | TX | RX | GPSEN | BUZZ | PROG | RA-01SH | HT-RA62
Top Silkscreen Layer: P1.06 | Lora
